# Altium project PCB_Project_Transmit_Stend_ver0.0.1.PrjPcb (part 1 of 2)
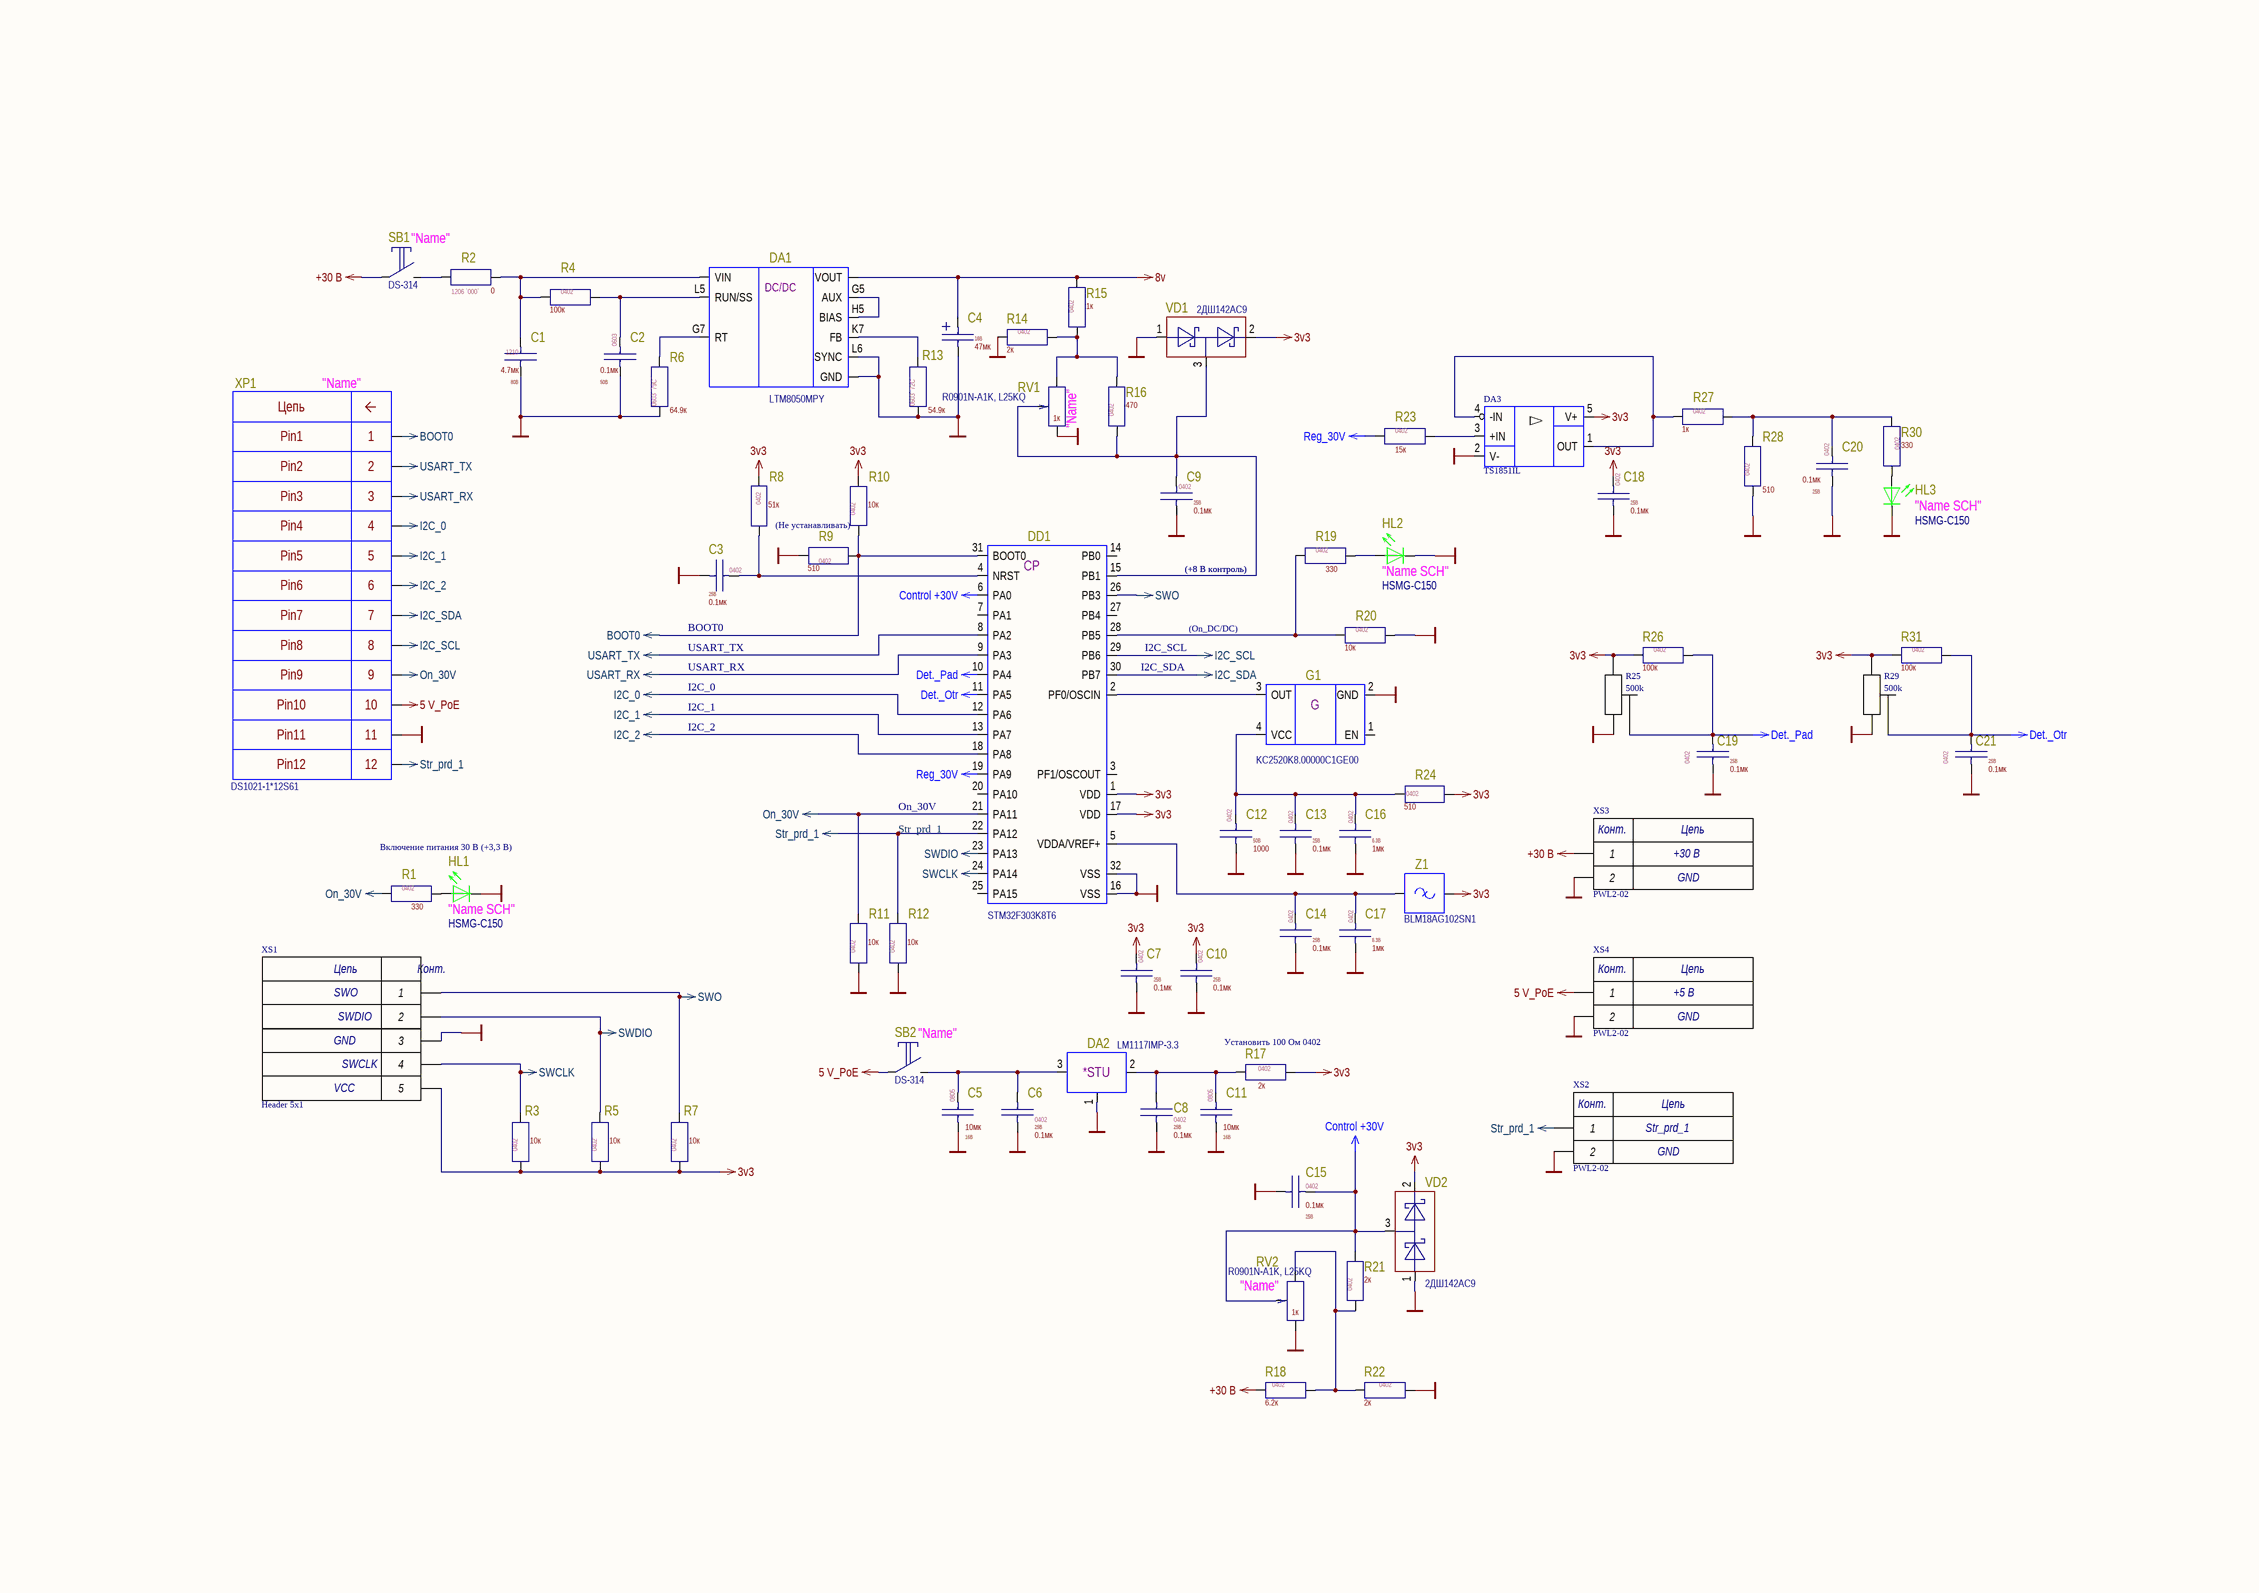
[diagram p0: Контроллер.SchDoc]
1 sheet, 72 parts. Net scope: global (net labels, ports and power ports of the same name join across sheets).
Board file: PPM_ver0.0.1.PcbDoc

## Sheet Контроллер.SchDoc: =GlobalProjectName
size A2; Date: {d}; Author: Стулов Н. Н.; Engineer: Отв.; SheetNumber: 1; SheetTotal: 1; PageSetup: Record=PageOptions|CenterHorizontal=False|CenterVertical=False|PrintScale=0.95|XCorrection=0.00|YCorrection=0.00|PrintKind=1|BorderSize=5000000|LeftOffset=0|BottomOffset=0|Orientation=1|PaperLength=1000|PaperWidth=1000|Scale=100|PaperSource=15|PrintQuality=600|MediaType=1|DitherType=10|PaperKind=A4|PrintScaleMode=1; Верхний Уровень: False; Format: A3; AddressAdd1Title: Отв.; CurrentTime: {ct}; CurrentDate: {cd}; Time: {t}; DocumentFullPathAndName: (dfpan}; DocumentName: {dn}; ModifiedDate: {md}; Rule: PcbType=ProtelPcb; ProjectName: {pn}

### Parts
C1  value 4.7мк  Корпус: 1210  Power\Voltage: 80В  [2.5X3.2 C H2.5 `MANUALLY]  (hidden comment: (1210) 4.7мкФ±20% 80В X7R [-55…+125°C])
C2  value 0.1мк  Корпус: 0603  Power\Voltage: 50В  [0.8X1.6 C H0.8 `MANUALLY]  (hidden comment: (0603) 0.1мкФ±10% 50В X7R [-55…+125°C])
C3  value 0.1мк  Корпус: 0402  Power\Voltage: 25В  [0.5X1 C H0.5 `MANUALLY]  (hidden comment: (0402) 0.1мкФ±20% 25В X7R [-55…+125°C])
C4  value 47мк  Power\Voltage: 16В  [3.2X6 WT2.2 C + H2.6 `C@AVX RoundedRectangle]  (hidden comment: (2412) (C) 47мкФ±20% 16В [-55…+125°C])
C5  value 10мк  Корпус: 0805  Power\Voltage: 16В  [1.3X2 C H0.9 `MANUALLY]  (hidden comment: (0805) 10мкФ±20% 16В X5R [-55…+85°C])
C6  value 0.1мк  Корпус: 0402  Power\Voltage: 25В  [0.5X1 C H0.5 `MANUALLY]  (hidden comment: (0402) 0.1мкФ±20% 25В X7R [-55…+125°C])
C7  value 0.1мк  Корпус: 0402  Power\Voltage: 25В  [0.5X1 C H0.5 `MANUALLY]  (hidden comment: (0402) 0.1мкФ±20% 25В X7R [-55…+125°C])
C8  value 0.1мк  Корпус: 0402  Power\Voltage: 25В  [0.5X1 C H0.5 `MANUALLY]  (hidden comment: (0402) 0.1мкФ±20% 25В X7R [-55…+125°C])
C9  value 0.1мк  Корпус: 0402  Power\Voltage: 25В  [0.5X1 C H0.5 `MANUALLY]  (hidden comment: (0402) 0.1мкФ±20% 25В X7R [-55…+125°C])
C10  value 0.1мк  Корпус: 0402  Power\Voltage: 25В  [0.5X1 C H0.5 `MANUALLY]  (hidden comment: (0402) 0.1мкФ±20% 25В X7R [-55…+125°C])
C11  value 10мк  Корпус: 0805  Power\Voltage: 16В  [1.3X2 C H0.9 `MANUALLY]  (hidden comment: (0805) 10мкФ±20% 16В X5R [-55…+85°C])
C12  value 1000  Корпус: 0402  Power\Voltage: 50В  [0.5X1 C H0.5 `MANUALLY]  (hidden comment: (0402) 1000пФ±5% 50В C0G [-55…+125°C])
C13  value 0.1мк  Корпус: 0402  Power\Voltage: 25В  [0.5X1 C H0.5 `MANUALLY]  (hidden comment: (0402) 0.1мкФ±20% 25В X7R [-55…+125°C])
C14  value 0.1мк  Корпус: 0402  Power\Voltage: 25В  [0.5X1 C H0.5 `MANUALLY]  (hidden comment: (0402) 0.1мкФ±20% 25В X7R [-55…+125°C])
C15  value 0.1мк  Корпус: 0402  Power\Voltage: 25В  [0.5X1 C H0.5 `MANUALLY]  (hidden comment: (0402) 0.1мкФ±20% 25В X7R [-55…+125°C])
C16  value 1мк  Корпус: 0402  Power\Voltage: 6.3В  [0.5X1 C H0.3 `MANUALLY]  (hidden comment: (0402) 1мкФ±20% 6.3В X5R [-55…+85°C])
C17  value 1мк  Корпус: 0402  Power\Voltage: 6.3В  [0.5X1 C H0.3 `MANUALLY]  (hidden comment: (0402) 1мкФ±20% 6.3В X5R [-55…+85°C])
C18  value 0.1мк  Корпус: 0402  Power\Voltage: 25В  [0.5X1 C H0.5 `MANUALLY]  (hidden comment: (0402) 0.1мкФ±20% 25В X7R [-55…+125°C])
C19  value 0.1мк  Корпус: 0402  Power\Voltage: 25В  [0.5X1 C H0.5 `MANUALLY]  (hidden comment: (0402) 0.1мкФ±20% 25В X7R [-55…+125°C])
C20  value 0.1мк  Корпус: 0402  Power\Voltage: 25В  [0.5X1 C H0.5 `MANUALLY]  (hidden comment: (0402) 0.1мкФ±20% 25В X7R [-55…+125°C])
C21  value 0.1мк  Корпус: 0402  Power\Voltage: 25В  [0.5X1 C H0.5 `MANUALLY]  (hidden comment: (0402) 0.1мкФ±20% 25В X7R [-55…+125°C])
DA1  ManufacturerPartNumber: LTM8050MPY  Функция: DC/DC  [15x9 =1.27 №L7 70balls]  (hidden comment: LTM8050MPY [DSBGA 15x9x5 70balls `LTM8050Y`] 15x9 =1.27 №L7 70balls)
DA2  ManufacturerPartNumber: LM1117IMP-3.3  Функция: *STU  [3.5 =2.3 №3 2[] `TI]  (hidden comment: LM1117IMP-3.3 [SOT-223 `N05B`] 3.5 =2.3 №3 2[] `TI)
DA3  TS1851IL  [1.6 =0.95 №5 H1.6]
DD1  ManufacturerPartNumber: STM32F303K8T6  Функция: CP  [7x7 =0.8 №32]  (hidden comment: STM32F303K8T6 [LQFP-32] 7x7 =0.8 №32)
G1  ManufacturerPartNumber: KC2520K8.00000C1GE00  Функция: G  [2.5x2 №4 H0.8 `Kyocera]  (hidden comment: KC2520B8.00000C1GE00)
HL1  _NameSCH: "Name SCH"  [1206 HSMG-C150]  (hidden comment: HSMG-C150)
HL2  _NameSCH: "Name SCH"  [1206 HSMG-C150]  (hidden comment: HSMG-C150)
HL3  _NameSCH: "Name SCH"  [1206 HSMG-C150]  (hidden comment: HSMG-C150)
R1  value 330  Корпус: 0402  [0.5X1 R H0.4 `MANUALLY]  (hidden comment: (0402) 330Ом±5%, 0.0625Вт, 25В)
R2  value 0  Корпус: 1206 `000`  [1.6X3.2 R H0.6 `MANUALLY]  (hidden comment: (1206 `000`) 0Ом, 200В)
R3  value 10к  Корпус: 0402  [0.5X1 R H0.4 `MANUALLY]  (hidden comment: (0402) 10кОм±5%, 0.0625Вт, 25В)
R4  value 100к  Корпус: 0402  [0.5X1 R H0.4 `MANUALLY]  (hidden comment: (0402) 100кОм±5%, 0.0625Вт, 25В)
R5  value 10к  Корпус: 0402  [0.5X1 R H0.4 `MANUALLY]  (hidden comment: (0402) 10кОм±5%, 0.0625Вт, 25В)
R6  value 64.9к  Корпус: 0603 `79C`  [0.8X1.6 R H0.5 `MANUALLY]  (hidden comment: (0603 `79C`) 64.9кОм±1%, 0.1Вт, 50В)
R7  value 10к  Корпус: 0402  [0.5X1 R H0.4 `MANUALLY]  (hidden comment: (0402) 10кОм±5%, 0.0625Вт, 25В)
R8  value 51к  Корпус: 0402  [0.5X1 R H0.4 `MANUALLY]  (hidden comment: (0402) 51кОм±5%, 0.0625Вт, 25В)
R9  value 510  Корпус: 0402  [0.5X1 R H0.4 `MANUALLY]  (hidden comment: (0402) 510Ом±5%, 0.0625Вт, 25В)
R10  value 10к  Корпус: 0402  [0.5X1 R H0.4 `MANUALLY]  (hidden comment: (0402) 10кОм±5%, 0.0625Вт, 25В)
R11  value 10к  Корпус: 0402  [0.5X1 R H0.4 `MANUALLY]  (hidden comment: (0402) 10кОм±5%, 0.0625Вт, 25В)
R12  value 10к  Корпус: 0402  [0.5X1 R H0.4 `MANUALLY]  (hidden comment: (0402) 10кОм±5%, 0.0625Вт, 25В)
R13  value 54.9к  Корпус: 0603 `72C`  [0.8X1.6 R H0.5 `MANUALLY]  (hidden comment: (0603 `72C`) 54.9кОм±1%, 0.1Вт, 50В)
R14  value 2к  Корпус: 0402  [0.5X1 R H0.4 `MANUALLY]  (hidden comment: (0402) 2кОм±5%, 0.0625Вт, 25В)
R15  value 1к  Корпус: 0402  [0.5X1 R H0.4 `MANUALLY]  (hidden comment: (0402) 1кОм±5%, 0.0625Вт, 25В)
R16  value 470  Корпус: 0402  [0.5X1 R H0.4 `MANUALLY]  (hidden comment: (0402) 470Ом±5%, 0.0625Вт, 25В)
R17  value 2к  Корпус: 0402  [0.5X1 R H0.4 `MANUALLY]  (hidden comment: (0402) 2кОм±5%, 0.0625Вт, 25В)
R18  value 6.2к  Корпус: 0402  [0.5X1 R H0.4 `MANUALLY]  (hidden comment: (0402) 6.2кОм±5%, 0.0625Вт, 25В)
R19  value 330  Корпус: 0402  [0.5X1 R H0.4 `MANUALLY]  (hidden comment: (0402) 330Ом±5%, 0.0625Вт, 25В)
R20  value 10к  Корпус: 0402  [0.5X1 R H0.4 `MANUALLY]  (hidden comment: (0402) 10кОм±5%, 0.0625Вт, 25В)
R21  value 2к  Корпус: 0402  [0.5X1 R H0.4 `MANUALLY]  (hidden comment: (0402) 2кОм±5%, 0.0625Вт, 25В)
R22  value 2к  Корпус: 0402  [0.5X1 R H0.4 `MANUALLY]  (hidden comment: (0402) 2кОм±5%, 0.0625Вт, 25В)
R23  value 15к  Корпус: 0402  [0.5X1 R H0.4 `MANUALLY]  (hidden comment: (0402) 15кОм±5%, 0.0625Вт, 25В)
R24  value 510  Корпус: 0402  [0.5X1 R H0.4 `MANUALLY]  (hidden comment: (0402) 510Ом±5%, 0.0625Вт, 25В)
R25  500k  [podstr_res_500kOhm]
R26  value 100к  Корпус: 0402  [0.5X1 R H0.4 `MANUALLY]  (hidden comment: (0402) 100кОм±5%, 0.0625Вт, 25В)
R27  value 1к  Корпус: 0402  [0.5X1 R H0.4 `MANUALLY]  (hidden comment: (0402) 1кОм±5%, 0.0625Вт, 25В)
R28  value 510  Корпус: 0402  [0.5X1 R H0.4 `MANUALLY]  (hidden comment: (0402) 510Ом±5%, 0.0625Вт, 25В)
R29  500k  [podstr_res_500kOhm]
R30  value 330  Корпус: 0402  [0.5X1 R H0.4 `MANUALLY]  (hidden comment: (0402) 330Ом±5%, 0.0625Вт, 25В)
R31  value 100к  Корпус: 0402  [0.5X1 R H0.4 `MANUALLY]  (hidden comment: (0402) 100кОм±5%, 0.0625Вт, 25В)
RV1  value 1к  NameSCH: "Name"  [R0901N-A L25 KQ]  (hidden comment: R0901N-A1K, L25KQ)
RV2  value 1к  NameSCH: "Name"  [R0901N-A L25 KQ]  (hidden comment: R0901N-A1K, L25KQ)
SB1  NameSCH: "Name"  [BUTTON]  (hidden comment: DS-314)
SB2  NameSCH: "Name"  [BUTTON]  (hidden comment: DS-314)
VD1  ManufacturerPartNumber: 2ДШ142АС9  [1.3 =1.9 №3 `RoundedRectangle]  (hidden comment: 2ДШ142АС9 [КТ-46A] 1.3 =1.9 №3)
VD2  ManufacturerPartNumber: 2ДШ142АС9  [1.3 =1.9 №3 `RoundedRectangle]  (hidden comment: 2ДШ142АС9 [КТ-46A] 1.3 =1.9 №3)
XP1  _Pin12: Pin12  _Pin9: Pin9  _Pin8: Pin8  _Pin7: Pin7  _Pin6: Pin6  _Pin5: Pin5  _Pin4: Pin4  _Pin3: Pin3  _Pin2: Pin2  _Pin1: Pin1  _Pin11: Pin11  _Pin10: Pin10  _NameSCH: "Name"  [6.1 H8.6 PCB3 №12]  (hidden comment: DS1021-1*12S61)
XS1  Header 5x1  [5PIN_2.54]
XS2  PWL2-02  [PWL2-02]
XS3  PWL2-02  [PWL2-02]
XS4  PWL2-02  [PWL2-02]
Z1  BLM18AG102SN1  [0.8x1.6 L H0.8 `RoundedRectangle]

### Nets
3v3: C7.2 C10.2 C18.2 DA3.5(V+) DD1.1(VDD) DD1.17(VDD) R3.1 R5.1 R7.1 R8.1 R10.2 R17.2 R24.1 R25.1 R26.1 R29.1 R31.1 VD1.2(C2) VD2.2(A2) XS1.5 Z1.2
5 V_PoE: SB2.1 XP1.10 XS4.1
8v: C4.1 DA1.A1(VOUT) R15.2
+30 В: R18.1 SB1.1 XS3.1
BOOT0: DD1.31(BOOT0) R9.1 R10.1 XP1.1
Control +30V: C15.2 DD1.6(PA0) R21.2 RV2.V(Variable) VD2.3(C)
Det._Otr: C21.2 DD1.11(PA5) R29.2 R31.2
Det._Pad: C19.2 DD1.10(PA4) R25.2 R26.2
GND: C1.1 C2.1 C3.1 C4.2 C5.1 C6.1 C7.1 C8.1 C9.1 C10.1 C11.1 C12.1 C13.1 C14.1 C15.1 C16.1 C17.1 C18.1 C19.1 C20.1 C21.1 DA1.A5(GND) DA1.A6(GND) DA1.A7(GND) DA1.B5(GND) DA1.B6(GND) DA1.B7(GND) DA1.C5(GND) DA1.C6(GND) DA1.C7(GND) DA1.D5(GND) DA1.D6(GND) DA1.D7(GND) DA1.E1(GND) DA1.E2(GND) DA1.E3(GND) DA1.E4(GND) DA1.E5(GND) DA1.E6(GND) DA1.E7(GND) DA1.F1(GND) DA1.F2(GND) DA1.F3(GND) DA1.F4(GND) DA1.F5(GND) DA1.F6(GND) DA1.F7(GND) DA1.G1(GND) DA1.G2(GND) DA1.G3(GND) DA1.G4(GND) DA1.G6(GND) DA1.H6(GND) DA1.J5(GND) DA1.J6(GND) DA1.K5(GND) DA1.K6(GND) DA1.L6(SYNC) DA1.L7(GND) DA2.1 DA3.2(V-) DD1.16(VSS) DD1.32(VSS) G1.2(GND) HL1.C HL2.C HL3.C R6.1 R9.2 R11.1 R12.1 R13.1 R14.1 R20.1 R22.2 R25.3 R28.1 R29.3 RV1.0(GND) RV1.1 RV2.0(GND) RV2.1 VD1.1(A1) VD2.1(A1) XP1.11 XS1.3 XS2.2 XS3.2 XS4.2
I2C_0: DD1.12(PA6) XP1.4
I2C_1: DD1.13(PA7) XP1.5
I2C_2: DD1.18(PA8) XP1.6
I2C_SCL: DD1.29(PB6) XP1.8
I2C_SDA: DD1.30(PB7) XP1.7
On_30V: DD1.21(PA11) R1.1 R11.2 XP1.9
Reg_30V: DD1.19(PA9) R23.1
Str_prd_1: DD1.22(PA12) R12.2 XP1.12 XS2.1
SWCLK: DD1.24(PA14) R3.2 XS1.4
SWDIO: DD1.23(PA13) R5.2 XS1.2
SWO: DD1.26(PB3) R7.2 XS1.1
USART_RX: DD1.9(PA3) XP1.3
USART_TX: DD1.8(PA2) XP1.2
NetC1_2: C1.2 DA1.L1(VIN) R2.2 R4.2
NetC2_2: C2.2 DA1.L5(RUN/SS) R4.1
NetC3_2: C3.2 DD1.4(NRST) R8.2
NetC5_2: C5.2 C6.2 DA2.3 SB2.2
NetC8_2: C8.2 C11.2 DA2.2 R17.1
NetC9_2: C9.2 DD1.15(PB1) R16.1 RV1.V(Variable) VD1.3(C1A2)
NetC12_2: C12.2 C13.2 C16.2 G1.4(VCC) R24.2
NetC14_2: C14.2 C17.2 DD1.5(VDDA/VREF+) Z1.1
NetC20_2: C20.2 R27.2 R28.2 R30.1
NetDA1_G5: DA1.G5(AUX) DA1.H5(BIAS)
NetDA1_G7: DA1.G7(RT) R6.2
NetDA1_K7: DA1.K7(FB) R13.2
NetDA3_1: DA3.1(OUT) DA3.4(-IN) R27.1
NetDA3_3: DA3.3(+IN) R23.2
NetDD1_2: DD1.2(PF0/OSCIN) G1.3(OUT)
NetDD1_28: DD1.28(PB5) R19.1 R20.2
NetHL1_A: HL1.A R1.2
NetHL2_A: HL2.A R19.2
NetHL3_A: HL3.A R30.2
NetR2_1: R2.1 SB1.2
NetR14_2: R14.2 R15.1 R16.2 RV1.2
NetR18_2: R18.2 R21.1 R22.1 RV2.2

Not connected (* = marked no-connect by the designer): DA1 A2(VOUT) A3(VOUT) A4(VOUT) B1(VOUT) B2(VOUT) B3(VOUT) B4(VOUT) C1(VOUT) C2(VOUT) C3(VOUT) C4(VOUT) D1(VOUT) D2(VOUT) D3(VOUT) D4(VOUT) H7(SHARE) J1(VIN) J2(VIN) J3(VIN) J7(PGOOD) K1(VIN) K2(VIN) K3(VIN) L2(VIN) L3(VIN); DD1 3(PF1/OSCOUT) 7(PA1) 14(PB0) 20(PA10) 25(PA15) 27(PB4); G1 1(EN)

### Notes on the sheet
- (near R10) (Не устанавливать)
- (+8 В контроль)
- USART_TX
- BOOT0
- (near DD1) I2C_SCL
- (On_DC/DC)
- USART_RX
- I2C_0
- (near DD1) I2C_SDA
- I2C_1
- I2C_2
- Включение питания 30 В (+3,3 В)
- (near DD1) Str_prd_1
- On_30V
- (near R17) Установить 100 Ом 0402
- THIS DOCUMENT AND THE DATA DISCLOSED HEREIN OR
- HEREWITH IS THE PROPERTY OF ALTIUM LIMITED AND MAY
- DWG NO:
- REVISION
- REV:
- DESCRIPTION
- DATE
- APPROVED
- BE FREELY DISTRIBUTED IN WHOLE. NO RIGHTS ARE
- RESERVED OR EXPRESS OR IMPLIED WARANTEE GIVEN.
- ENG:
- APPROVALS
- PROJECT
- DSN:
- CHK:
- REFERENCE DOCUMENTS
- PROJECT REVISION:
- TITLE
- DOCUMENT REVISION:
- DESIGN ITEM:
- BOM:
- FAB DWG:
- PCB DWG:
- ASSY DWG:
- SCALE:
- A3
- SIZE
- CAGE CODE
- FILE NAME
- DWG NO.
- SHEET
- OF
- REV
- (in symbol 9000003830483) Цепь
- (in symbol SWD_6pin) Цепь; Конт.; SWO; SWDIO; GND; SWCLK; VCC
- (in symbol XS 5V) Конт.; Цепь; +5 В; GND
- (in symbol XS 30V) Конт.; Цепь; +30 В; GND
- (in symbol XS str_prd_1) Конт.; Цепь; Str_prd_1; GND